# Altium schematic sheet SENSE.SchDoc
size C; SheetNumber: 1; SheetTotal: 3
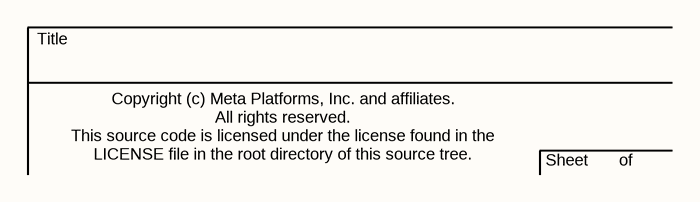
[diagram p0: SENSE.SchDoc]

## Notes on the sheet
- Title
- Copyright (c) Meta Platforms, Inc. and affiliates.
  All rights reserved.
  This source code is licensed under the license found in the
  LICENSE file in the root directory of this source tree.
- Sheet
- of